# Altium schematic sheet mini四轴.SchDoc
size A4
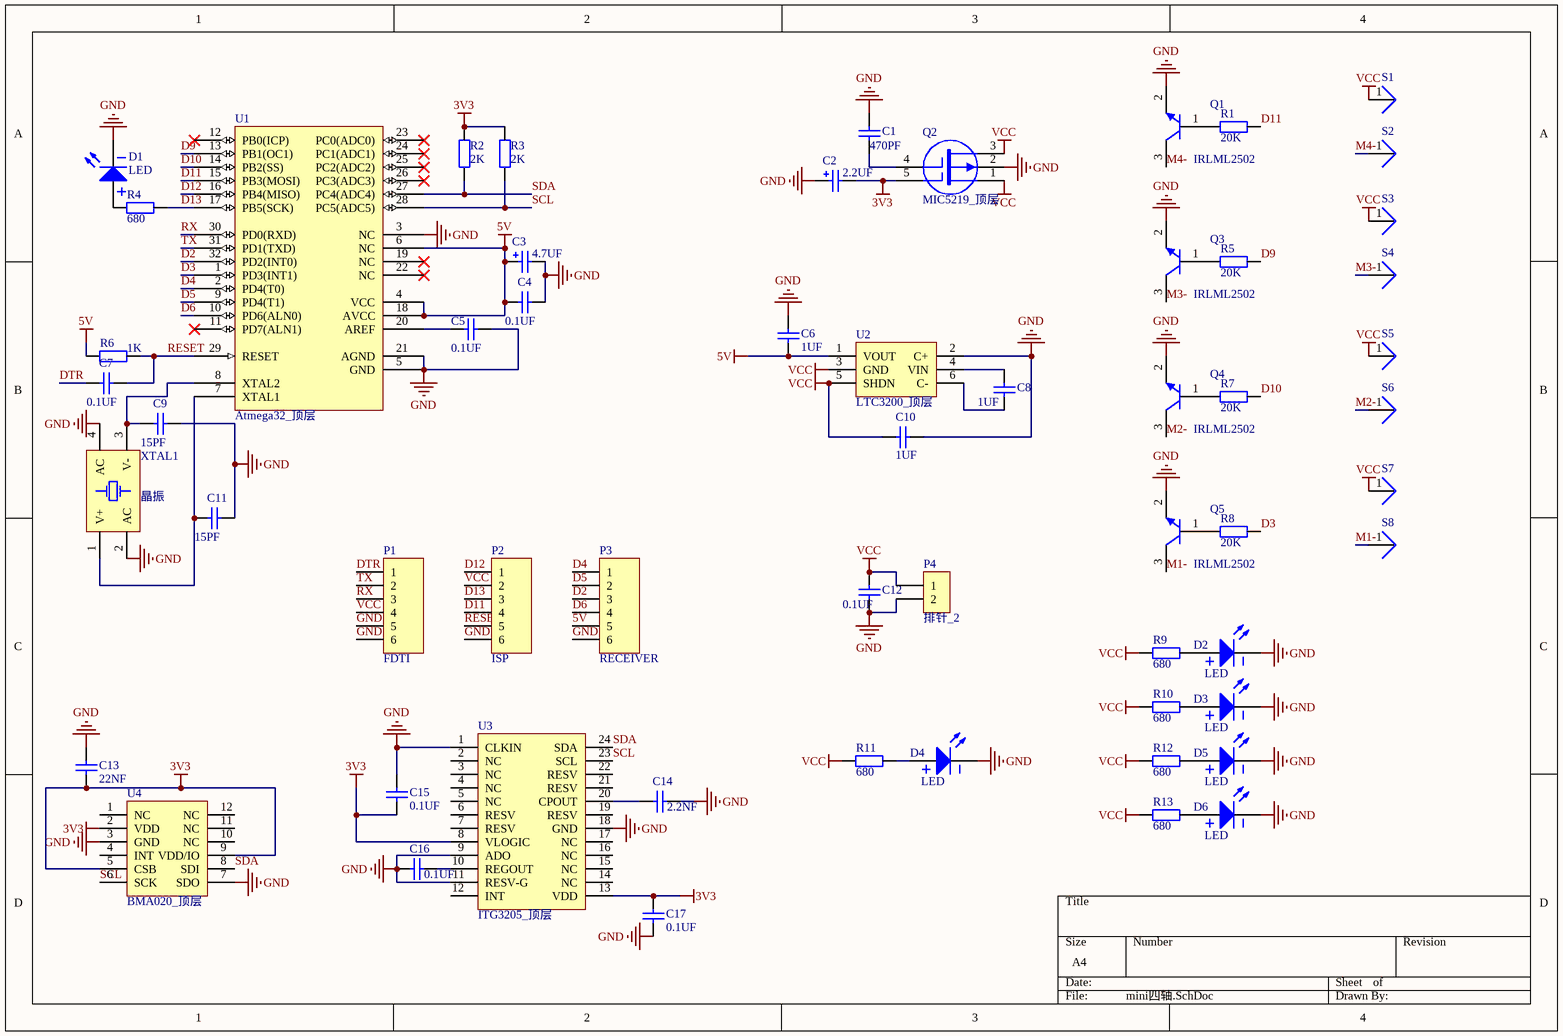
[diagram p0: mini四轴.SchDoc]

## Parts
C1  470PF  [0805_顶层]
C2  2.2UF  [A型电容]
C3  4.7UF  [A型电容]
C4  0.1UF  [0805_顶层]
C5  0.1UF  [0805_顶层]
C6  1UF  [0805_顶层]
C7  0.1UF  [0805_顶层]
C8  1UF  [0805_顶层]
C9  15PF  [0805_顶层]
C10  1UF  [0805_顶层]
C11  15PF  [0805_顶层]
C12  0.1UF  [0805_顶层]
C13  22NF  [0805_顶层]
C14  2.2NF  [0805_顶层]
C15  0.1UF  [0805_顶层]
C16  0.1UF  [0805_顶层]
C17  0.1UF  [0805_顶层]
D1  LED  [0805_顶层]
D2  LED  [0805_顶层]
D3  LED  [0805_顶层]
D4  LED  [0805_顶层]
D5  LED  [0805_顶层]
D6  LED  [0805_顶层]
P1  FDTI  [排针_6_2.54]
P2  ISP  [排针_6_2.54]
P3  RECEIVER  [排针_6_2.54]
P4  排针_2  [排针_2]
Q1  IRLML2502  [IRLML2502_顶层]
Q2  MIC5219_顶层  [MIC5219_顶层]
Q3  IRLML2502  [IRLML2502_顶层]
Q4  IRLML2502  [IRLML2502_顶层]
Q5  IRLML2502  [IRLML2502_顶层]
R1  20K  [0805_顶层]
R2  2K  [0805_顶层]
R3  2K  [0805_顶层]
R4  680  [0805_顶层]
R5  20K  [0805_顶层]
R6  1K  [0805_顶层]
R7  20K  [0805_顶层]
R8  20K  [0805_顶层]
R9  680  [0805_顶层]
R10  680  [0805_顶层]
R11  680  [0805_顶层]
R12  680  [0805_顶层]
R13  680  [0805_顶层]
S1  (no value)  [焊盘_顶层]
S2  (no value)  [焊盘_顶层]
S3  (no value)  [焊盘_顶层]
S4  (no value)  [焊盘_顶层]
S5  (no value)  [焊盘_顶层]
S6  (no value)  [焊盘_顶层]
S7  (no value)  [焊盘_顶层]
S8  (no value)  [焊盘_顶层]
U1  Atmega32_顶层  [Atmega32_顶层]
U2  LTC3200_顶层  [LTC3200_顶层]
U3  ITG3205_顶层  [ITG3205_顶层]
U4  BMA020_顶层  [BMA020_顶层]
XTAL1  晶振  [晶振_3225_顶层]

## Nets
3V3: C2.2 C13.1 C15.1 C17.2 Q2.5 R2.1 R3.1 U3.8(VLOGIC) U3.13(VDD) U4.2(VDD) U4.5(CSB) U4.9(VDD/IO)
5V: C3.1 C4.1 C6.1 P3.5 R6.2 U1.4(VCC) U1.6(NC) U1.18(AVCC) U2.1(VOUT)
GND: C1.2 C2.1 C3.2 C4.2 C5.2 C6.2 C9.2 C10.1 C11.2 C12.1 C13.2 C14.2 C15.2 C16.1 C17.1 D1.2(K) D2.2(K) D3.2(K) D4.2(K) D5.2(K) D6.2(K) P1.5 P1.6 P2.6 P3.6 P4.2 Q1.2 Q2.2 Q3.2 Q4.2 Q5.2 U1.3(NC) U1.5(GND) U1.21(AGND) U2.2(C+) U3.1(CLKIN) U3.9(ADO) U3.11(RESV-G) U3.18(GND) U4.3(GND) U4.7(SDO) XTAL1.2(AC) XTAL1.4(AC)
VCC: C10.2 C12.2 P1.4 P2.2 P4.1 Q2.1 Q2.3 R9.2 R10.2 R11.2 R12.2 R13.2 S1.1 S3.1 S5.1 S7.1 U2.3(GND) U2.5(SHDN)
D2: P3.3 U1.32(PD2(INT0))
D3: R8.1 U1.1(PD3(INT1))
D4: P3.1 U1.2(PD4(T0))
D5: P3.2 U1.9(PD4(T1))
D6: P3.4 U1.10(PD6(ALN0))
D9: R5.1 U1.13(PB1(OC1))
D10: R7.1 U1.14(PB2(SS))
D11: P2.4 R1.1 U1.15(PB3(MOSI))
D12: P2.1 U1.16(PB4(MISO))
D13: P2.3 R4.1 U1.17(PB5(SCK))
DTR: C7.1 P1.1
M1-: Q5.3 S8.1
M2-: Q4.3 S6.1
M3-: Q3.3 S4.1
M4-: Q1.3 S2.1
RESET: C7.2 P2.5 R6.1 U1.29(RESET)
RX: P1.3 U1.30(PD0(RXD))
SCL: R3.2 U1.28(PC5(ADC5)) U3.23(SCL) U4.6(SCK)
SDA: R2.2 U1.27(PC4(ADC4)) U3.24(SDA) U4.8(SDI)
TX: P1.2 U1.31(PD1(TXD))
NetC1_1: C1.1 Q2.4
NetC5_1: C5.1 U1.20(AREF)
NetC8_1: C8.1 U2.4(VIN)
NetC8_2: C8.2 U2.6(C-)
NetC9_1: C9.1 U1.8(XTAL2) XTAL1.3(V-)
NetC11_1: C11.1 U1.7(XTAL1) XTAL1.1(V+)
NetC14_1: C14.1 U3.20(CPOUT)
NetC16_2: C16.2 U3.10(REGOUT)
NetD1_1: D1.1(A) R4.2
NetD2_1: D2.1(A) R9.1
NetD3_1: D3.1(A) R10.1
NetD4_1: D4.1(A) R11.1
NetD5_1: D5.1(A) R12.1
NetD6_1: D6.1(A) R13.1
NetQ1_1: Q1.1 R1.2
NetQ3_1: Q3.1 R5.2
NetQ4_1: Q4.1 R7.2
NetQ5_1: Q5.1 R8.2

Not connected (* = marked no-connect by the designer): U1 11(PD7(ALN1))* 12(PB0(ICP))* 19(NC)* 22(NC)* 23(PC0(ADC0))* 24(PC1(ADC1))* 25(PC2(ADC2))* 26(PC3(ADC3))*; U3 2(NC) 3(NC) 4(NC) 5(NC) 6(RESV) 7(RESV) 12(INT) 14(NC) 15(NC) 16(NC) 17(NC) 19(RESV) 21(RESV) 22(RESV); U4 1(NC) 4(INT) 10(NC) 11(NC) 12(NC)

## Library data of the parts
C1 C4-C17 = 电容_无极性_0805_顶层: 电容
C2 C3 = 电容_A型
D1-D6 = LED_0805_顶层
P1-P3 = 排针_6_2.54
Q1 Q3-Q5 = IRLML2502_顶层
Q2 = MIC5219_顶层: MIC5219
R1-R13 = 电阻_0805_顶层: 电阻
S1-S8 = 焊盘_顶层: 焊盘
U1 = Atmega32_顶层: Atmega32
U2 = LTC3200_顶层: LTC3200
U3 = ITG3205_顶层: ITG3205
U4 = BMA020_顶层: BMA020
XTAL1 = 晶振_3225_顶层